# Altium schematic sheet 12V_out_driver.SchDoc
size A
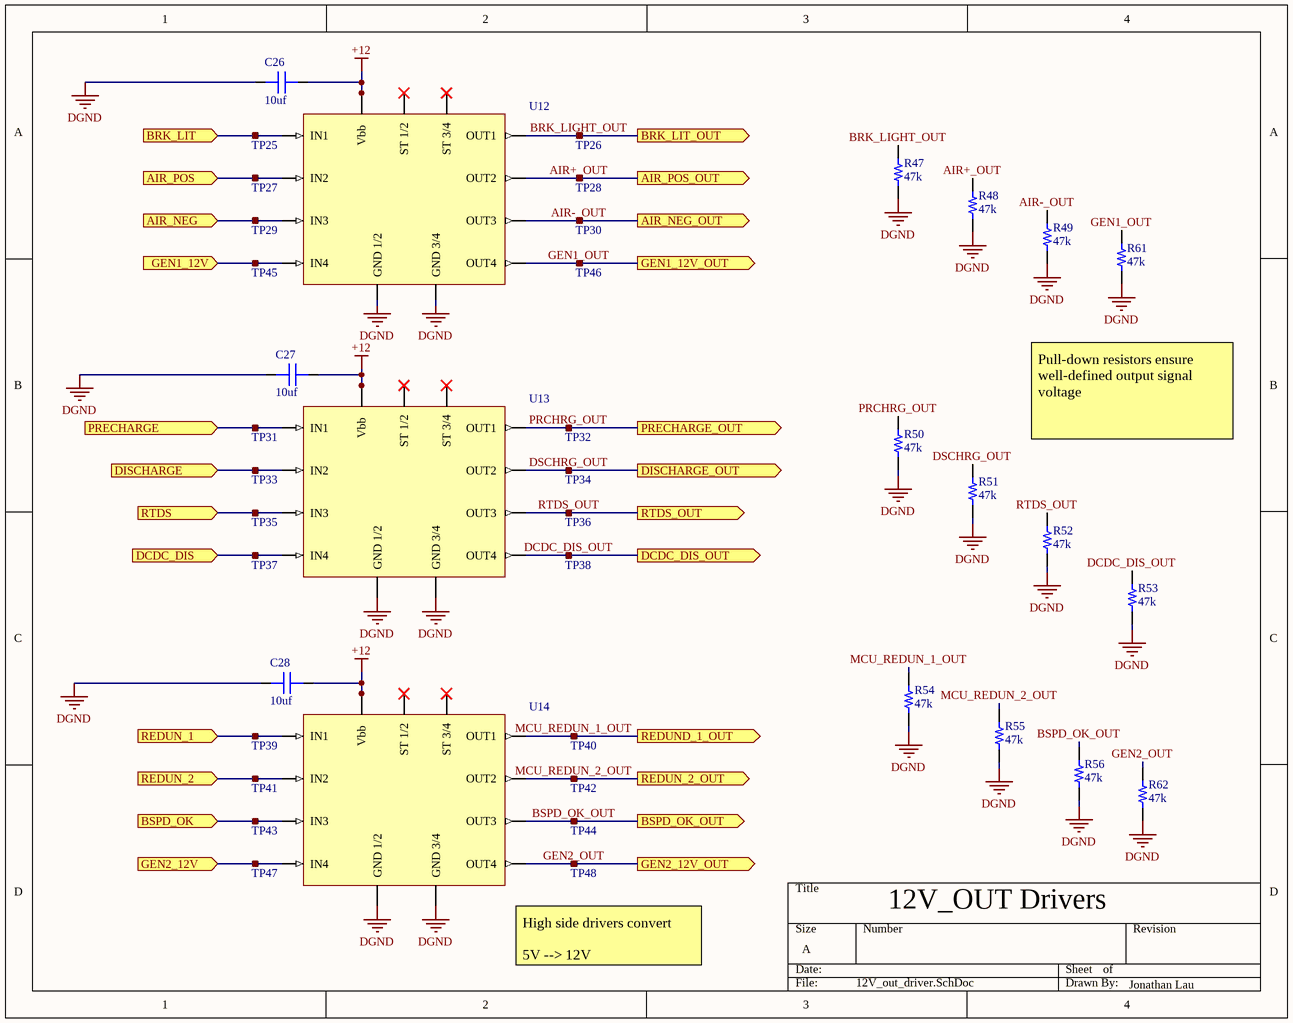
[diagram p0: 12V_out_driver.SchDoc]

## Parts
C26  value 10uf  [CAP 0603/1608]  (hidden comment: Capacitor MLCC 10uf 16V CAP 0603/1608)
C27  value 10uf  [CAP 0603/1608]  (hidden comment: Capacitor MLCC 10uf 16V CAP 0603/1608)
C28  value 10uf  [CAP 0603/1608]  (hidden comment: Capacitor MLCC 10uf 16V CAP 0603/1608)
R47  value 47k  [RES 0805/2012]  (hidden comment: Resistor 47k 0805 1/4W 5%)
R48  value 47k  [RES 0805/2012]  (hidden comment: Resistor 47k 0805 1/4W 5%)
R49  value 47k  [RES 0805/2012]  (hidden comment: Resistor 47k 0805 1/4W 5%)
R50  value 47k  [RES 0805/2012]  (hidden comment: Resistor 47k 0805 1/4W 5%)
R51  value 47k  [RES 0805/2012]  (hidden comment: Resistor 47k 0805 1/4W 5%)
R52  value 47k  [RES 0805/2012]  (hidden comment: Resistor 47k 0805 1/4W 5%)
R53  value 47k  [RES 0805/2012]  (hidden comment: Resistor 47k 0805 1/4W 5%)
R54  value 47k  [RES 0805/2012]  (hidden comment: Resistor 47k 0805 1/4W 5%)
R55  value 47k  [RES 0805/2012]  (hidden comment: Resistor 47k 0805 1/4W 5%)
R56  value 47k  [RES 0805/2012]  (hidden comment: Resistor 47k 0805 1/4W 5%)
R61  value 47k  [RES 0805/2012]  (hidden comment: Resistor 47k 0805 1/4W 5%)
R62  value 47k  [RES 0805/2012]  (hidden comment: Resistor 47k 0805 1/4W 5%)
TP25  RCU-0C  [RCU-0C]  (value not drawn)
TP26  RCU-0C  [RCU-0C]  (value not drawn)
TP27  RCU-0C  [RCU-0C]  (value not drawn)
TP28  RCU-0C  [RCU-0C]  (value not drawn)
TP29  RCU-0C  [RCU-0C]  (value not drawn)
TP30  RCU-0C  [RCU-0C]  (value not drawn)
TP31  RCU-0C  [RCU-0C]  (value not drawn)
TP32  RCU-0C  [RCU-0C]  (value not drawn)
TP33  RCU-0C  [RCU-0C]  (value not drawn)
TP34  RCU-0C  [RCU-0C]  (value not drawn)
TP35  RCU-0C  [RCU-0C]  (value not drawn)
TP36  RCU-0C  [RCU-0C]  (value not drawn)
TP37  RCU-0C  [RCU-0C]  (value not drawn)
TP38  RCU-0C  [RCU-0C]  (value not drawn)
TP39  RCU-0C  [RCU-0C]  (value not drawn)
TP40  RCU-0C  [RCU-0C]  (value not drawn)
TP41  RCU-0C  [RCU-0C]  (value not drawn)
TP42  RCU-0C  [RCU-0C]  (value not drawn)
TP43  RCU-0C  [RCU-0C]  (value not drawn)
TP44  RCU-0C  [RCU-0C]  (value not drawn)
TP45  RCU-0C  [RCU-0C]  (value not drawn)
TP46  RCU-0C  [RCU-0C]  (value not drawn)
TP47  RCU-0C  [RCU-0C]  (value not drawn)
TP48  RCU-0C  [RCU-0C]  (value not drawn)
U12  PG-DSO-20  [PG-DSO-20]  (value not drawn)
U13  PG-DSO-20  [PG-DSO-20]  (value not drawn)
U14  PG-DSO-20  [PG-DSO-20]  (value not drawn)

## Ports
AIR_NEG (in), AIR_NEG_OUT (out), AIR_POS (in), AIR_POS_OUT (out), BRK_LIT (in), BRK_LIT_OUT (out), BSPD_OK (in), BSPD_OK_OUT (out), DCDC_DIS (in), DCDC_DIS_OUT (out), DISCHARGE (in), DISCHARGE_OUT (out), GEN1_12V (in), GEN1_12V_OUT (out), GEN2_12V (in), GEN2_12V_OUT (out), PRECHARGE (in), PRECHARGE_OUT (out), REDUN_1 (in), REDUN_2 (in), REDUN_2_OUT (out), REDUND_1_OUT (out), RTDS (in), RTDS_OUT (out)

## Nets
+12: C26.2 C27.2 C28.2 U12.1(Vbb) U12.10(Vbb) U12.11(Vbb) U12.12(Vbb) U12.15(Vbb) U12.16(Vbb) U12.19(Vbb) U12.20(Vbb) U13.1(Vbb) U13.10(Vbb) U13.11(Vbb) U13.12(Vbb) U13.15(Vbb) U13.16(Vbb) U13.19(Vbb) U13.20(Vbb) U14.1(Vbb) U14.10(Vbb) U14.11(Vbb) U14.12(Vbb) U14.15(Vbb) U14.16(Vbb) U14.19(Vbb) U14.20(Vbb)
DGND: C26.1 C27.1 C28.1 R47.1 R48.1 R49.1 R50.1 R51.1 R52.1 R53.1 R54.1 R55.1 R56.1 R61.1 R62.1 U12.2(GND_1/2) U12.6(GND_3/4) U13.2(GND_1/2) U13.6(GND_3/4) U14.2(GND_1/2) U14.6(GND_3/4)
AIR+_OUT: R48.2 TP28.1 U12.17(OUT2) ; port AIR_POS_OUT
AIR-_OUT: R49.2 TP30.1 U12.14(OUT3) ; port AIR_NEG_OUT
AIR_NEG: TP29.1 U12.7(IN3) ; port AIR_NEG
AIR_POS: TP27.1 U12.5(IN2) ; port AIR_POS
BRK_LIGHT_OUT: R47.2 TP26.1 U12.18(OUT1) ; port BRK_LIT_OUT
BRK_LIT: TP25.1 U12.3(IN1) ; port BRK_LIT
BSPD_OK: TP43.1 U14.7(IN3) ; port BSPD_OK
BSPD_OK_OUT: R56.2 TP44.1 U14.14(OUT3) ; port BSPD_OK_OUT
DCDC_DIS: TP37.1 U13.9(IN4) ; port DCDC_DIS
DCDC_DIS_OUT: R53.2 TP38.1 U13.13(OUT4) ; port DCDC_DIS_OUT
DISCHARGE: TP33.1 U13.5(IN2) ; port DISCHARGE
DSCHRG_OUT: R51.2 TP34.1 U13.17(OUT2) ; port DISCHARGE_OUT
GEN1_12V: TP45.1 U12.9(IN4) ; port GEN1_12V
GEN1_OUT: R61.2 TP46.1 U12.13(OUT4) ; port GEN1_12V_OUT
GEN2_12V: TP47.1 U14.9(IN4) ; port GEN2_12V
GEN2_OUT: R62.2 TP48.1 U14.13(OUT4) ; port GEN2_12V_OUT
MCU_REDUN_1_OUT: R54.2 TP40.1 U14.18(OUT1) ; port REDUND_1_OUT
MCU_REDUN_2_OUT: R55.2 TP42.1 U14.17(OUT2) ; port REDUN_2_OUT
PRCHRG_OUT: R50.2 TP32.1 U13.18(OUT1) ; port PRECHARGE_OUT
PRECHARGE: TP31.1 U13.3(IN1) ; port PRECHARGE
REDUN_1: TP39.1 U14.3(IN1) ; port REDUN_1
REDUN_2: TP41.1 U14.5(IN2) ; port REDUN_2
RTDS: TP35.1 U13.7(IN3) ; port RTDS
RTDS_OUT: R52.2 TP36.1 U13.14(OUT3) ; port RTDS_OUT

Not connected (* = marked no-connect by the designer): U12 4(ST_1/2)* 8(ST_3/4)*; U13 4(ST_1/2)* 8(ST_3/4)*; U14 4(ST_1/2)* 8(ST_3/4)*

## Notes on the sheet
- Pull-down resistors ensure well-defined output signal voltage
- (near U14) High side drivers convert
  5V --> 12V
- 12V_OUT Drivers
- Jonathan Lau

## Library data of the parts
C26-C28 = 235: Manufacturer_id: 1; idCapacitor: 235; Name: Cap_10uf_16V_CAP 0603/1608; Dielectric: Ceramic; Created_By: Nick Mah; Drawer_id: 1; Voltage_Rating: 16V; Package: CAP 0603/1608; Created_Date: 10/20/2018
R47-R56 R61 R62 = 1841: Manufacturer_id: 1; idResistor: 1841; Name: Res_47k_0805_1/4W_5%; Created_By: Nick Mah; Supplier 1: Digi-Key; Drawer_id: 1; Tolerance: 5%; Power: 1/4W; Package: 0805; ComponentLink1Description: Datasheet; Created_Date: 2018-10-20
TP25-TP48 = 5: Manufacturer_id: 1; idTable: 5; Name: RCU-0C_Test_Point; Drawer_id: 1; Package: 0603; MfrPartNo: RCU-0C; Link: https://www.digikey.com/product-detail/en/te-connectivity-amp-connectors/RCU-0C/A106145CT-ND/3477802; ComponentLink1Description: Datasheet; ComponentLink1URL: https://www.te.com/commerce/DocumentDelivery/DDEController?Action=srchrtrv&DocNm=1773266&DocType=DS&DocLang=English
U12-U14 = 6: High Side Driver; Manufacturer_id: 1; MfrPartNo: BTS716GXUMA1; idIC_Misc: 6; Name: BTS716G High Side Driver; Drawer_id: 1; Link: https://www.digikey.com/product-detail/en/infineon-technologies/BTS716GXUMA1/BTS716GXUMA1CT-ND/520067; ComponentLink1Description: Datasheet; ComponentLink1URL: https://www.infineon.com/dgdl/Infineon-BTS716G-DS-v01_00-EN.pdf?fileId=5546d4625a888733015aa3be86601004